# Altium project UC3525_IGBT_Welding_Board.PrjPcb
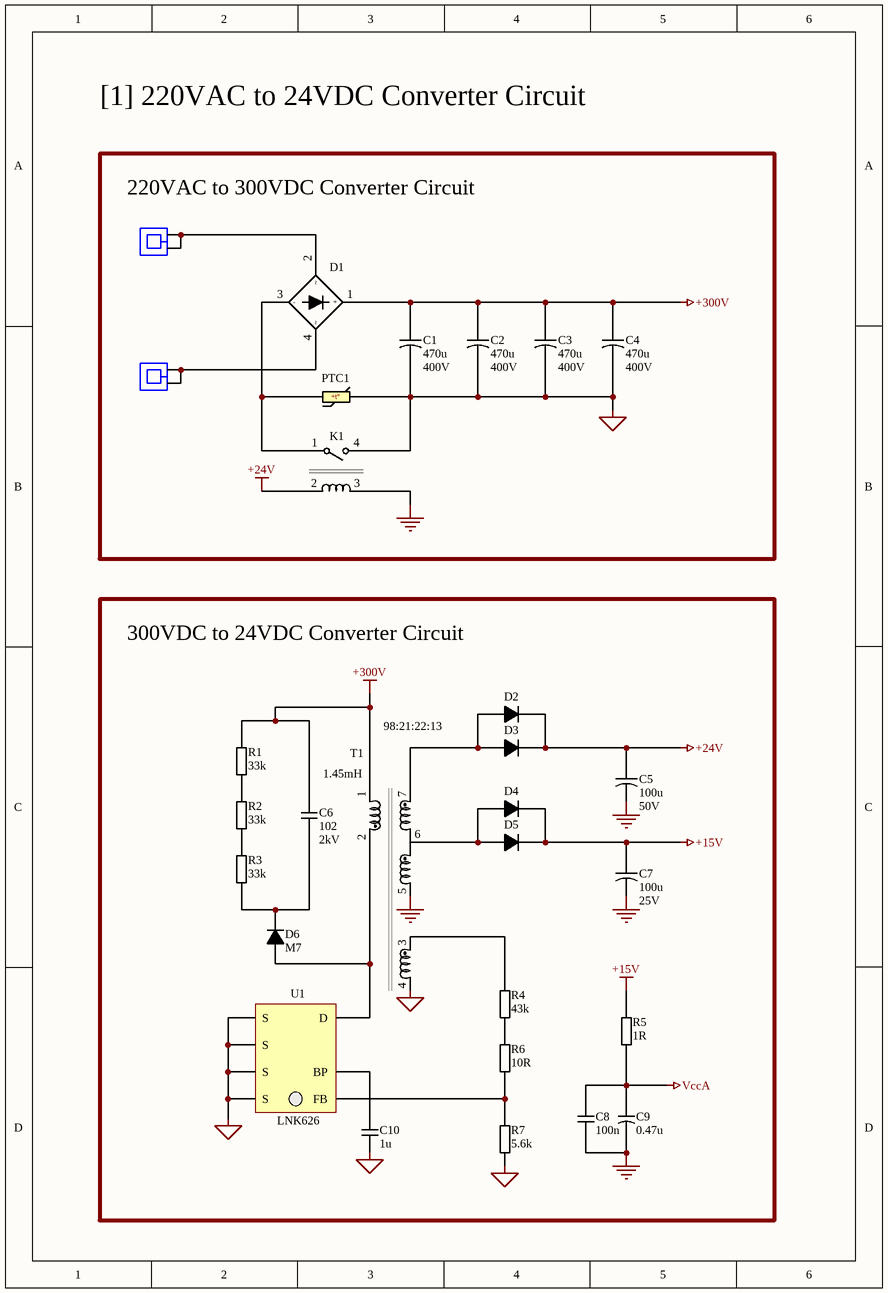
[diagram p0: 220VAC_to_24VDC.SchDoc]
3 sheets, 163 parts. Net scope: flat (ports and power ports of the same name join across sheets).
Board file: UC3525_IGBT_Welding_Board.PcbDoc
Sheets:
  220VAC_to_24VDC.SchDoc
  Control_Circuit.SchDoc
  Half_Bridge_Push_Pull_Circuit.SchDoc

## Sheet 220VAC_to_24VDC.SchDoc
size 165 x 241 mm; DocumentNumber: 1; SheetNumber: 1; SheetTotal: 3

### Parts
C1  470u  Voltage: 400V  [Cap_THD_Alum_10mm]
C2  470u  Voltage: 400V  [Cap_THD_Alum_10mm]
C3  470u  Voltage: 400V  [Cap_THD_Alum_10mm]
C4  470u  Voltage: 400V  [Cap_THD_Alum_10mm]
C5  100u  Voltage: 50V  [Cap_THD_Alum_2.5mm]
C6  102  Voltage: 2kV  [Cap_THD_HVCeramic_5mm]
C7  100u  Voltage: 25V  [Cap_THD_Alum_2.5mm]
C8  100n  [Cap_SMD_0805]
C9  0.47u  [Cap_THD_Tantalum_2.5mm]
C10  1u  [Cap_SMD_0805]
D1  D  [Bridge_THD_14.3mm]  (value not drawn)
D2  UF4007  [Diode_THD_10.8mm]  (value not drawn)
D3  UF4007  [Diode_THD_10.8mm]  (value not drawn)
D4  UF4007  [Diode_THD_10.8mm]  (value not drawn)
D5  UF4007  [Diode_THD_10.8mm]  (value not drawn)
D6  M7  [Diode_SMD_3.9mm]
J1  63824-1  [CONN_QC_Faston_5mm]  (value not drawn)
J2  63824-1  [CONN_QC_Faston_5mm]  (value not drawn)
K1  K  [Relay_10mm]  (value not drawn)
PTC1  (no value)  [PTC_THD_5mm]
R1  33k  [Res_SMD_0805]
R2  33k  [Res_SMD_0805]
R3  33k  [Res_SMD_0805]
R4  43k  [Res_SMD_0805]
R5  1R  [Res_SMD_2512]
R6  10R  [Res_SMD_0805]
R7  5.6k  [Res_SMD_0805]
T1  1.45mH  Turns Ratio: 98:21:22:13  [XFMR_BR22EEL_1179A]
U1  LNK626  [DIP8]

### Blocks framed on the sheet
220VAC to 300VDC Converter Circuit: C1-C4 D1 J1 J2 K1 PTC1
300VDC to 24VDC Converter Circuit: C5-C10 D2-D6 R1-R7 T1 U1

### Nets
+15V: C7.1(+) D4.2(K) D5.2(K) R5.1
+24V: C5.1(+) D2.2(K) D3.2(K) K1.2(Coil_1)
+300V: C1.1(+) C2.1(+) C3.1(+) C4.1(+) C6.2 D1.1(+) R1.2 T1.1
GND: C5.2(-) C7.2(-) C8.1 C9.2(-) K1.3(Coil_2) T1.5
GND_1: C1.2(-) C2.2(-) C3.2(-) C4.2(-) C10.1 K1.4(SW_2) PTC1.2 R7.1 T1.4 U1.5(S) U1.6(S) U1.7(S) U1.8(S)
VccA: C8.2 C9.1(+) R5.2
NetC6_1: C6.1 D6.1(K) R3.1
NetC10_2: C10.2 U1.2(BP)
NetD1_2: D1.2 J1.1 J1.2
NetD1_3: D1.3(-) K1.1(SW_1) PTC1.1
NetD1_4: D1.4 J2.1 J2.2
NetD2_1: D2.1(A) D3.1(A) T1.7
NetD4_1: D4.1(A) D5.1(A) T1.6
NetD6_2: D6.2(A) T1.2 U1.4(D)
NetR1_1: R1.1 R2.2
NetR2_1: R2.1 R3.2
NetR4_1: R4.1 R6.2
NetR4_2: R4.2 T1.3
NetR6_1: R6.1 R7.2 U1.1(FB)

Not connected (* = marked no-connect by the designer): U1 3(NC)

### Notes on the sheet
- [1] 220VAC to 24VDC Converter Circuit
- (in symbol ICL_PTC) +t°

### Library data of the parts
C1-C5 C7 = Cap_THD_Alum: THD Aluminum Capacitor
C6 = Cap_THD_Ceramic: THD Ceramic Capacitor
C8 C10 = Cap_SMD_0805: 0805 SMD Capacitor
C9 = Cap_THD_Tantalum_2.5mm: Voltage: V
D1 = Diode_Bridge_V1: Full Wave Diode Bridge 1
D2-D6 = Diode_Rectifier: Rectifier Diode
J1 J2 = CONN_QC_Faston: Quick Connect Terminal; Manufacturer: TE Connectivity; Body Material: Brass; Plating: Tin; Gender: Male; Insulation: Non-Insulated; Tab Width: 6.35mm; Tab Thickness: 0.83mm; Mating Tab Width: 0.25inch; Hole Diameter: 0.055inch; PCB Thickness: 0.062inch; Supplier 1: Arrow Electronics; Manufacturer Part Number: 63824-1; RoHS: Yes; Category: Terminals; Stock 1: 23665; Pricing 1: 1=0.0808, 10=0.0729, 25=0.053, 100=0.0524, 250=0.0519, 500=0.0514, 1000=0.0509, 3000=0.0504, 6000=0.0448, 15000=0.0426 (USD); Mount: Through Hole; Contact Material: Brass; Contact Plating: Tin; Color: Silver; Material: Brass; Body Plating: Tin; Terminal Material: Brass; Min Operating Temperature: -30°C; Max Operating Temperature: 110°C; Package Quantity: 10000; Packaging: Tape and Reel; Termination: Tab; Orientation: Straight; Series: Faston; Length: 13.63mm; Height: 14.02mm; Depth: 7.92mm; Size: 0.032inch; Radiation Hardening: No; Lead Free: Lead Free; ELV: Compliant; RoHS Compliant: Yes; Reach SVHC Compliant: Unknown; ComponentLink1URL: https://datasheet.ciiva.com/11721/0900766b80ddd72b-11721738.pdf?src-supplier=Rs; ComponentLink1Description: https://datasheet.ciiva.com/11721/0900766b80ddd72b-11721738.pdf?src-supplier=Rs; ComponentLink2URL: https://datasheet.ciiva.com/839/eng-cd-63824-r-basefilename-839115.pdf?src-supplier=Digi-Key; ComponentLink2Description: https://datasheet.ciiva.com/839/eng-cd-63824-r-basefilename-839115.pdf?src-supplier=Digi-Key; ComponentLink3URL: https://datasheet.ciiva.com/46393/1650963-46393511.pdf?src-supplier=Element14; ComponentLink3Description: https://datasheet.ciiva.com/46393/1650963-46393511.pdf?src-supplier=Element14; ComponentLink4URL: https://datasheet.ciiva.com/7873/1650963-7873563.pdf?src-supplier=Element14; ComponentLink4Description: https://datasheet.ciiva.com/7873/1650963-7873563.pdf?src-supplier=Element14; ComponentLink5URL: https://datasheet.ciiva.com/3144/eng-cs-82004-faston-pcb-tabs-receptacles-0914-3144076.pdf?src-supplier=Avnet; ComponentLink5Description: https://datasheet.ciiva.com/3144/eng-cs-82004-faston-pcb-tabs-receptacles-0914-3144076.pdf?src-supplier=Avnet; Supplier Part Number 1: 63824-1
K1 = Relay_Generic_V2
PTC1 = ICL_PTC: PTC Inrush Current Limiters
R1-R7 = Res_SMD: SMD Resistor
T1 = XFMR_BR22EEL_1179A: 98:21:22:13 Pulse Transformer; Lprimary: 1.45mH

## Sheet Control_Circuit.SchDoc
size A3; DocumentNumber: 2; SheetNumber: 2; SheetTotal: 3
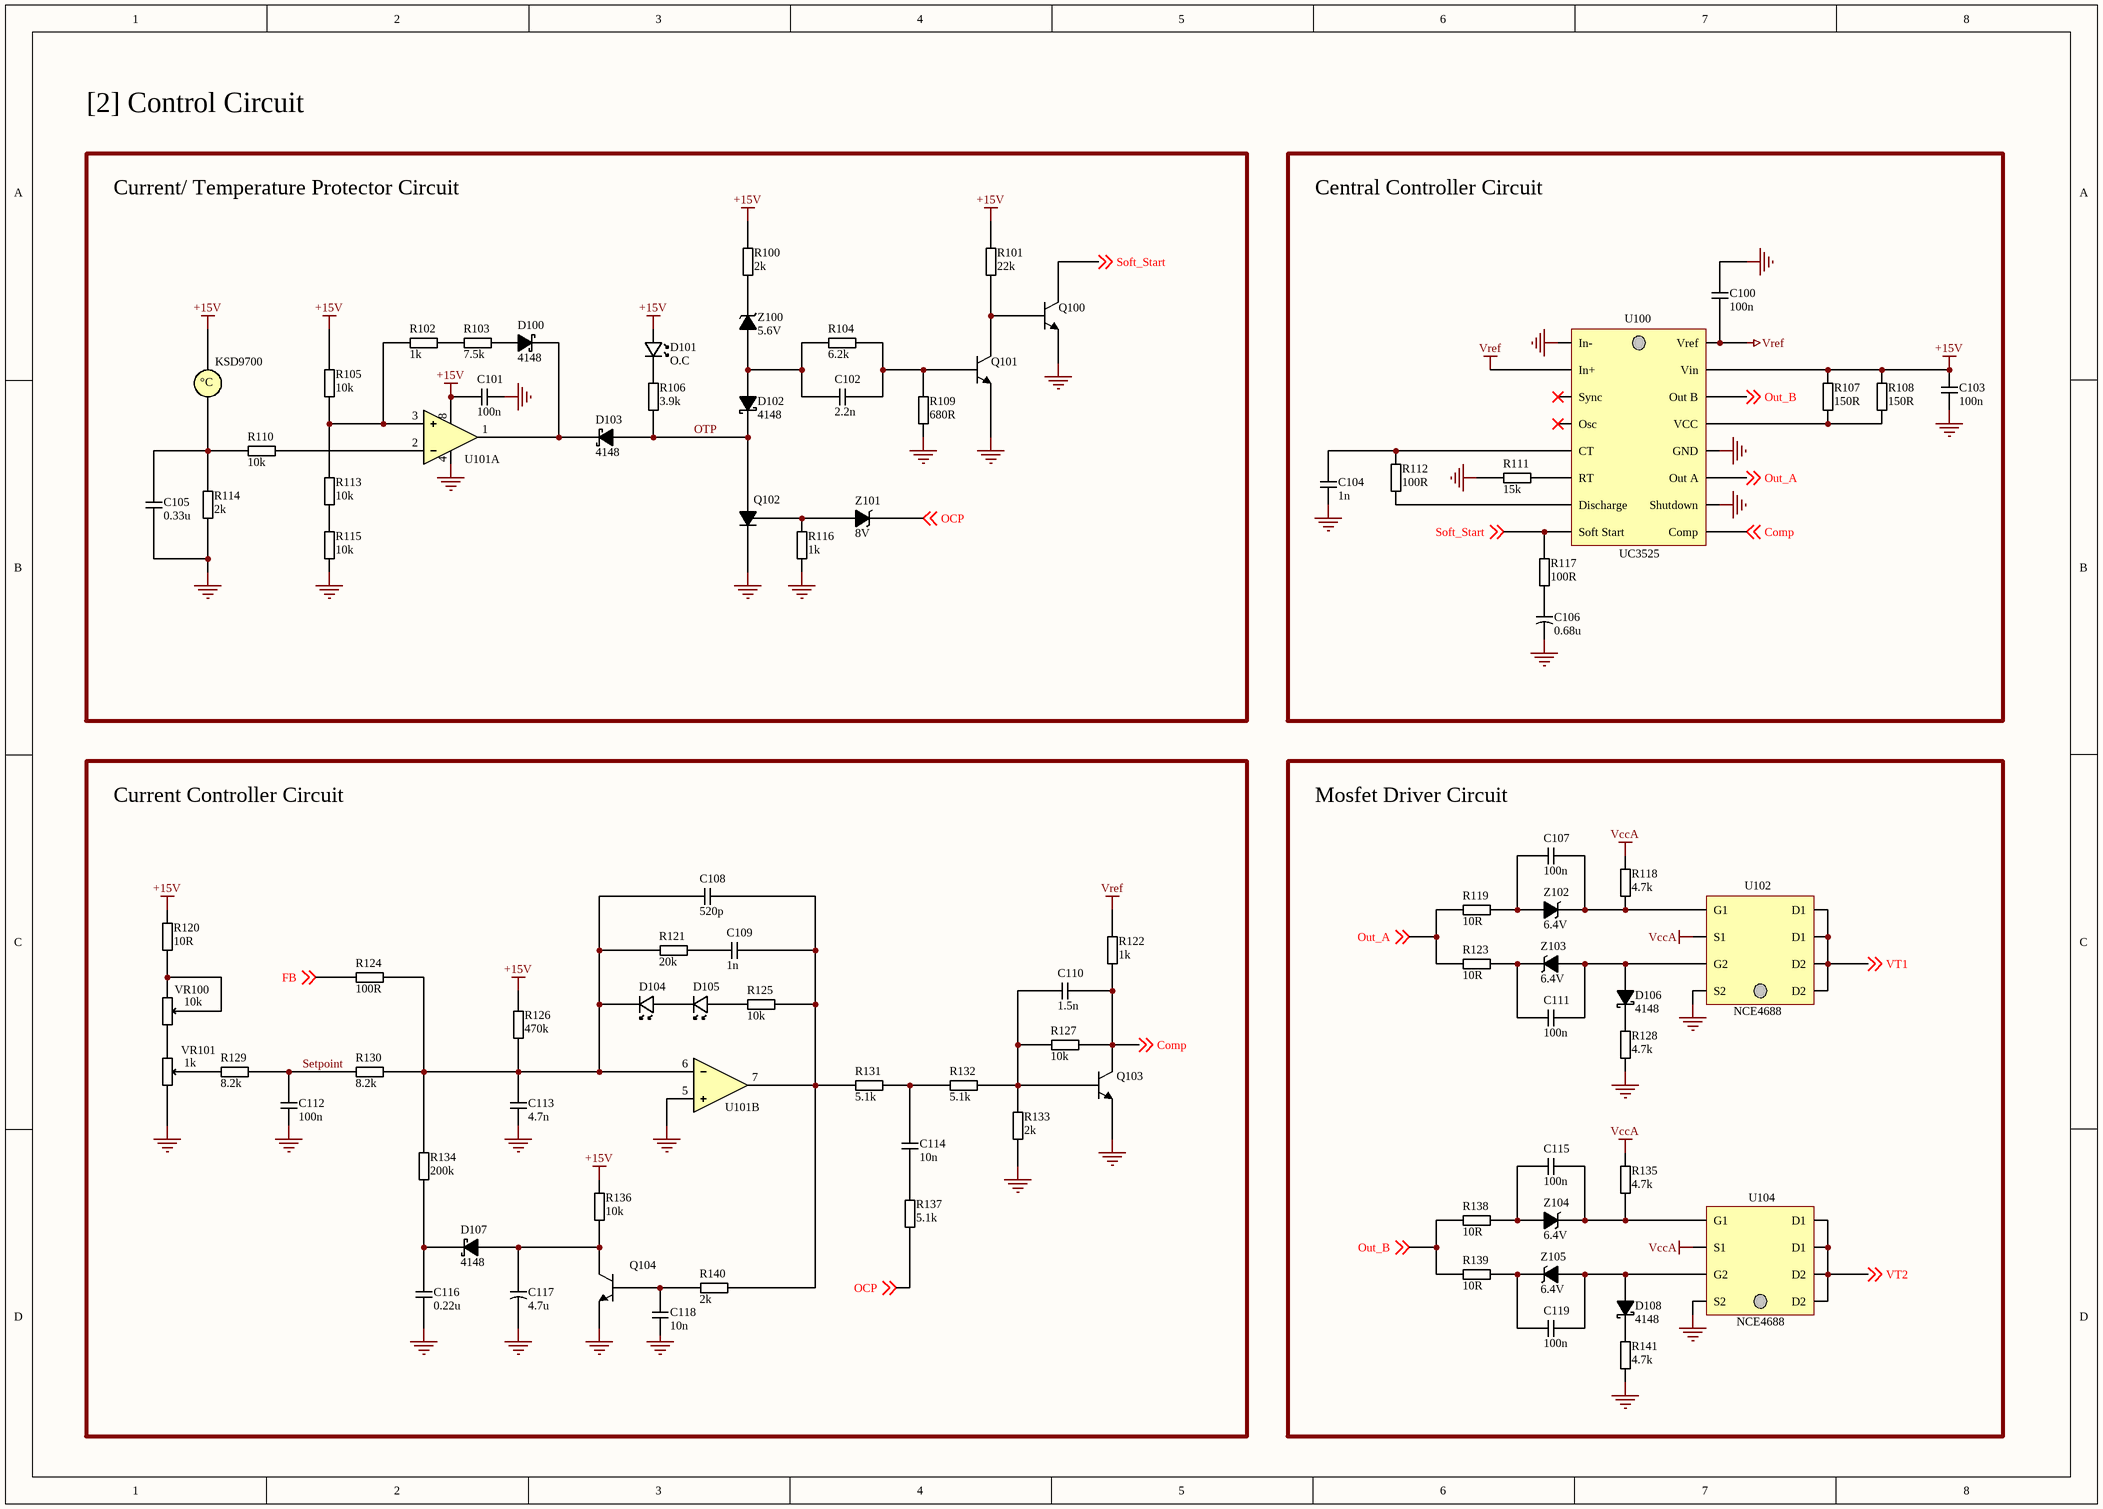
[diagram p1: Control_Circuit.SchDoc]

### Parts
C100  100n  [Cap_SMD_0805]
C101  100n  [Cap_SMD_0805]
C102  2.2n  [Cap_SMD_0805]
C103  100n  [Cap_SMD_0805]
C104  1n  [Cap_SMD_0805]
C105  0.33u  [Cap_SMD_0805]
C106  0.68u  [Cap_THD_Tantalum_2.5mm]
C107  100n  [Cap_SMD_0805]
C108  520p  [Cap_SMD_0805]
C109  1n  [Cap_SMD_0805]
C110  1.5n  [Cap_SMD_0805]
C111  100n  [Cap_SMD_0805]
C112  100n  [Cap_SMD_0805]
C113  4.7n  [Cap_SMD_0805]
C114  10n  [Cap_SMD_0805]
C115  100n  [Cap_SMD_0805]
C116  0.22u  [Cap_SMD_0805]
C117  4.7u  [Cap_THD_Tantalum_2.5mm]
C118  10n  [Cap_SMD_0805]
C119  100n  [Cap_SMD_0805]
D100  4148  [Diode_SMD_4.8mm]
D101  O.C  [Led_SMD_0805]
D102  4148  [Diode_SMD_4.8mm]
D103  4148  [Diode_SMD_4.8mm]
D104  D  [Led_SMD_0805]  (value not drawn)
D105  D  [Led_SMD_0805]  (value not drawn)
D106  4148  [Diode_SMD_4.8mm]
D107  4148  [Diode_SMD_4.8mm]
D108  4148  [Diode_SMD_4.8mm]
K100  KSD9700  [CONN_XH_2P_2.5mm]
Q100  8050  [SOT23 - 2mm]  (value not drawn)
Q101  8050  [SOT23 - 2mm]  (value not drawn)
Q102  MCR100-6  [SOT23 - 2mm]  (value not drawn)
Q103  8050  [SOT23 - 2mm]  (value not drawn)
Q104  8050  [SOT23 - 2mm]  (value not drawn)
R100  2k  [Res_SMD_0805]
R101  22k  [Res_SMD_0805]
R102  1k  [Res_SMD_0805]
R103  7.5k  [Res_SMD_0805]
R104  6.2k  [Res_SMD_0805]
R105  10k  [Res_SMD_0805]
R106  3.9k  [Res_SMD_0805]
R107  150R  [Res_SMD_0805]
R108  150R  [Res_SMD_0805]
R109  680R  [Res_SMD_0805]
R110  10k  [Res_SMD_0805]
R111  15k  [Res_SMD_0805]
R112  100R  [Res_SMD_0805]
R113  10k  [Res_SMD_0805]
R114  2k  [Res_SMD_0805]
R115  10k  [Res_SMD_0805]
R116  1k  [Res_SMD_0805]
R117  100R  [Res_SMD_0805]
R118  4.7k  [Res_SMD_0805]
R119  10R  [Res_SMD_0805]
R120  10R  [Res_SMD_0805]
R121  20k  [Res_SMD_0805]
R122  1k  [Res_SMD_0805]
R123  10R  [Res_SMD_0805]
R124  100R  [Res_SMD_0805]
R125  10k  [Res_SMD_0805]
R126  470k  [Res_SMD_0805]
R127  10k  [Res_SMD_0805]
R128  4.7k  [Res_SMD_0805]
R129  8.2k  [Res_SMD_0805]
R130  8.2k  [Res_SMD_0805]
R131  5.1k  [Res_SMD_0805]
R132  5.1k  [Res_SMD_0805]
R133  2k  [Res_SMD_0805]
R134  200k  [Res_SMD_0805]
R135  4.7k  [Res_SMD_0805]
R136  10k  [Res_SMD_0805]
R137  5.1k  [Res_SMD_0805]
R138  10R  [Res_SMD_0805]
R139  10R  [Res_SMD_0805]
R140  2k  [Res_SMD_0805]
R141  4.7k  [Res_SMD_0805]
U100  UC3525  [SOP16]
U101  OPAMP_LM358_V1  [SOP8]  (value not drawn)  (parts A,B of 2)
U102  NCE4688  [SOP8]
U104  NCE4688  [SOP8]
VR100  10k  [Trimmer_2.54mm]
VR101  1k  [Trimmer_2.54mm]
Z100  5.6V  [Diode_SMD_4.8mm]
Z101  8V  [Diode_SMD_4.8mm]
Z102  6.4V  [Diode_SMD_4.8mm]
Z103  6.4V  [Diode_SMD_4.8mm]
Z104  6.4V  [Diode_SMD_4.8mm]
Z105  6.4V  [Diode_SMD_4.8mm]

### Blocks framed on the sheet
Current/ Temperature Protector Circuit: C101 C102 C105 D100-D103 K100 Q100-Q102 R100-R106 R109 R110 R113-R116 U101 Z100 Z101
Central Controller Circuit: C100 C103 C104 C106 R107 R108 R111 R112 R117 U100
Current Controller Circuit: C108-C110 C112-C114 C116-C118 D104 D105 D107 Q103 Q104 R120-R122 R124-R127 R129-R134 R136 R137 R140 U101 VR100 VR101
Mosfet Driver Circuit: C107 C111 C115 C119 D106 D108 R118 R119 R123 R128 R135 R138 R139 R141 U102 U104 Z102-Z105

### Nets
+15V: C101.2 C103.2 D101.1(A) K100.1 R100.2 R101.2 R105.1 R107.2 R108.2 R120.2 R126.2 R136.2 U100.15(Vin) U101.8(V+)
GND: C100.2 C101.1 C103.1 C104.1 C105.2 C106.2(-) C112.2 C113.2 C116.2 C117.2(-) C118.2 Q100.1(E) Q101.1(E) Q102.2(K) Q103.1(E) Q104.1(E) R109.1 R111.1 R114.1 R115.2 R116.1 R128.2 R133.2 R141.2 U100.1(In-) U100.10(Shutdown) U100.12(GND) U101.4(V-) U101.5(In2+) U102.1(S2) U104.1(S2) VR101.3
VccA: R118.2 R135.1 U102.3(S1) U104.3(S1)
Vref: C100.1 R122.2 U100.2(In+) U100.16(Vref)
Comp: C110.1 Q103.3(C) R122.1 R127.1 U100.9(Comp) ; off-sheet Comp
FB: R124.2 ; off-sheet FB
OCP: R137.1 Z101.2(K) ; off-sheet OCP
OTP: D102.2(K) D103.1(A) Q102.1(A) R106.2
Out_A: R119.1 R123.1 U100.11(Out_A) ; off-sheet Out_A
Out_B: R138.1 R139.1 U100.14(Out_B) ; off-sheet Out_B
Setpoint: C112.1 R129.1 R130.2
Soft_Start: Q100.3(C) R117.2 U100.8(Soft_Start) ; off-sheet Soft_Start
VT1: U102.5(D1) U102.6(D1) U102.7(D2) U102.8(D2) ; off-sheet VT1
VT2: U104.5(D1) U104.6(D1) U104.7(D2) U104.8(D2) ; off-sheet VT2
NetC102_1: C102.1 Q101.2(B) R104.1 R109.2
NetC102_2: C102.2 D102.1(A) R104.2 Z100.1(A)
NetC104_2: C104.2 R112.2 U100.5(CT)
NetC105_1: C105.1 K100.2 R110.1 R114.2
NetC106_1: C106.1(+) R117.1
NetC107_1: C107.1 R118.1 U102.4(G1) Z102.2(K)
NetC107_2: C107.2 R119.2 Z102.1(A)
NetC108_1: C108.1 C109.1 R125.2 R131.1 R140.1 U101.7(Out2)
NetC108_2: C108.2 C113.1 D104.1(K) R121.1 R124.1 R126.1 R130.1 R134.2 U101.6(In2-)
NetC109_2: C109.2 R121.2
NetC110_2: C110.2 Q103.2(B) R127.2 R132.2 R133.1
NetC111_1: C111.1 D106.1(A) U102.2(G2) Z103.1(A)
NetC111_2: C111.2 R123.2 Z103.2(K)
NetC114_1: C114.1 R137.2
NetC114_2: C114.2 R131.2 R132.1
NetC115_1: C115.1 R135.2 U104.4(G1) Z104.2(K)
NetC115_2: C115.2 R138.2 Z104.1(A)
NetC116_1: C116.1 D107.2(K) R134.1
NetC117_1: C117.1(+) D107.1(A) Q104.3(C) R136.1
NetC118_1: C118.1 Q104.2(B) R140.2
NetC119_1: C119.1 D108.1(A) U104.2(G2) Z105.1(A)
NetC119_2: C119.2 R139.2 Z105.2(K)
NetD100_1: D100.1(A) R103.2
NetD100_2: D100.2(K) D103.2(K) U101.1(Out1)
NetD101_2: D101.2(K) R106.1
NetD104_2: D104.2(A) D105.1(K)
NetD105_2: D105.2(A) R125.1
NetD106_2: D106.2(K) R128.1
NetD108_2: D108.2(K) R141.1
NetQ100_2: Q100.2(B) Q101.3(C) R101.1
NetQ102_3: Q102.3(G) R116.2 Z101.1(A)
NetR100_1: R100.1 Z100.2(K)
NetR102_1: R102.1 R105.2 R113.1 U101.3(In1+)
NetR102_2: R102.2 R103.1
NetR107_1: R107.1 R108.1 U100.13(VCC)
NetR110_2: R110.2 U101.2(In1-)
NetR111_2: R111.2 U100.6(RT)
NetR112_1: R112.1 U100.7(Discharge)
NetR113_2: R113.2 R115.1
NetR120_1: R120.1 VR100.1 VR100.2
NetR129_2: R129.2 VR101.2
NetVR100_3: VR100.3 VR101.1

Not connected (* = marked no-connect by the designer): U100 3(Sync)* 4(Osc)*

### Notes on the sheet
- [2] Control Circuit
- (in symbol Relay_KSD9700) °C

### Library data of the parts
C100-C105 C107-C116 C118 C119 = Cap_SMD_0805: 0805 SMD Capacitor
C106 C117 = Cap_THD_Tantalum_2.5mm: Voltage: V
D100 D102 D103 D106-D108 = Diode_Schottky: Schottky Diode
D101 = Diode_LED: Light Emitting Diode - LED
D104 D105 = LED White
K100 = Relay_KSD9700: KSD-9700 series thermal protector
Q100 Q101 Q103 Q104 = BJT_SS8050_V1: Bipolar Transistor BJT NPN Epitaxial Silicon 25V 1500mA 100MHz 1W TO-92-3; Manufacturer: ON Semiconductor / Fairchild; Manufacturer Part Number: SS8050DTA; Max Collector Current: 1.5A; Collector-emitter Voltage-Max: 500mV; hFE Min: 85; Collector Base Voltage (VCBO): 40V; Emitter Base Voltage (VEBO): 6V; Supplier 1: Future Electronics; RoHS: Yes; Category: BJTs; Stock 1: 10000; Pricing 1: 2000=0.0536, 6000=0.0516, 20000=0.0496, 40000=0.0484, 80000=0.0463 (USD); Mount: Through Hole; Case/Package: TO-92-3; Number of Pins: 3; Weight: 0.24g; Min Operating Temperature: -65°C; Max Operating Temperature: 150°C; Packaging: Ammo Pack; Series: -; Package Quantity: 2000; Max Power Dissipation: 1W; Transition Frequency: 100MHz; Collector Emitter Breakdown Voltage: 25V; Polarity: NPN; Collector Emitter Saturation Voltage: 500mV; Gain Bandwidth Product: 100MHz; Voltage Rating (DC): 25V; Collector Emitter Voltage (VCEO): 25V; Max Breakdown Voltage: 25V; Current Rating: 1.5A; Length: 4.58mm; Width: 3.86mm; Height: 4.58mm; Radiation Hardening: No; RoHS Compliant: Yes; Lead Free: Lead Free; Reach SVHC Compliant: No; ComponentLink1URL: https://datasheet.ciiva.com/4721/ss8050-117753-4721333.pdf?src-supplier=Mouser; ComponentLink1Description: https://datasheet.ciiva.com/4721/ss8050-117753-4721333.pdf?src-supplier=Mouser; ComponentLink2URL: https://datasheet.ciiva.com/11207/ss8050-11207512.pdf?src-supplier=Avnet; ComponentLink2Description: https://datasheet.ciiva.com/11207/ss8050-11207512.pdf?src-supplier=Avnet; ComponentLink3URL: https://datasheet.ciiva.com/18648/ss8050-18648133.pdf?src-supplier=Digi-Key; ComponentLink3Description: https://datasheet.ciiva.com/18648/ss8050-18648133.pdf?src-supplier=Digi-Key; ComponentLink4URL: https://datasheet.ciiva.com/17447/ss8050-17447834.pdf?src-supplier=Future+Electronics; ComponentLink4Description: https://datasheet.ciiva.com/17447/ss8050-17447834.pdf?src-supplier=Future+Electronics; ComponentLink5URL: https://datasheet.ciiva.com/46415/1868828-46415608.pdf?src-supplier=Element14; ComponentLink5Description: https://datasheet.ciiva.com/46415/1868828-46415608.pdf?src-supplier=Element14; Supplier Part Number 1: 7178421
Q102 = SCR_MCR100_6_V1: Thyristor SCR 400V 10A 3-Pin TO-92 Tape and Ammo; Manufacturer: ON Semiconductor; Manufacturer Part Number: MCR100-6ZL1G; Hold Current: 5mA; Current Rating: 800mA; Supplier 1: Avnet; RoHS: Yes; Category: SCRs; Stock 1: 1846; Case/Package: TO-92-3; Number of Pins: 3; Min Operating Temperature: -40°C; Max Operating Temperature: 110°C; Voltage Rating (DC): 400V; Packaging: Tape and Reel; Series: -; Package Quantity: 2000; RMS Current (Irms): 800mA; Max Repetitive Reverse Voltage (Vrrm): 400V; Radiation Hardening: No; RoHS Compliant: Yes; Lead Free: Lead Free; ComponentLink1URL: https://datasheet.ciiva.com/3054/mcr100-d-3054696.pdf?src-supplier=Avnet; ComponentLink1Description: https://datasheet.ciiva.com/3054/mcr100-d-3054696.pdf?src-supplier=Avnet; ComponentLink2URL: https://datasheet.ciiva.com/6366/mcr100-d-6366847.pdf?src-supplier=Digi-Key; ComponentLink2Description: https://datasheet.ciiva.com/6366/mcr100-d-6366847.pdf?src-supplier=Digi-Key; ComponentLink3URL: https://datasheet.ciiva.com/16453/mcr100-d-16453261.pdf?src-supplier=Future+Electronics; ComponentLink3Description: https://datasheet.ciiva.com/16453/mcr100-d-16453261.pdf?src-supplier=Future+Electronics; Supplier Part Number 1: MCR100-6ZL1G
R100-R141 = Res_SMD_0805: 0805 SMD Resistor
U100 = PMIC_UC3525: Enhanced 35V, Dual 0.4A 400KHz PWM controller with Low output when off, 0C to 70C 16-PDIP 0 to 70; Manufacturer: Texas Instruments; Manufacturer Part Number: UC3525BN; Output Current: 400mA; Rise Time: 100ns; Number of Outputs: 2; Max Duty Cycle: 49%; Fall Time: 50ns; Topology: Flyback,Push-Pull; Output Voltage: 18V; Output Configuration: Positive; Number of Output Phases: 1; Synchronous Rectifier: Yes; Quiescent Current: 14mA; Supplier 1: Mouser; RoHS: Yes; Category: Voltage Regulators - Switching; Stock 1: 185; Pricing 1: 1=6.72, 10=6.42, 50=5.45, 100=5.2, 1000=4.31, 10000=4.31 (USD); Case/Package: N; Number of Pins: 16; Weight: 0.037172oz; Min Operating Temperature: 0°C; Max Operating Temperature: 70°C; Packaging: Rail/Tube; Switching Frequency: 400kHz; Series: -; Max Supply Voltage: 35V; Duty Cycle: 49%; Clock Sync: Yes; Radiation Hardening: No; Lead Free: Lead Free; RoHS Compliant: Yes; ComponentLink1URL: https://datasheet.ciiva.com/15108/getdatasheetpartid-189083-15108224.pdf?src-supplier=Verical; ComponentLink1Description: https://datasheet.ciiva.com/15108/getdatasheetpartid-189083-15108224.pdf?src-supplier=Verical; ComponentLink2URL: https://datasheet.ciiva.com/2016/uc2525b-2016182.pdf?src-supplier=Digi-Key; ComponentLink2Description: https://datasheet.ciiva.com/2016/uc2525b-2016182.pdf?src-supplier=Digi-Key; ComponentLink3URL: https://datasheet.ciiva.com/14250/slus376-14250904.pdf?src-supplier=Avnet; ComponentLink3Description: https://datasheet.ciiva.com/14250/slus376-14250904.pdf?src-supplier=Avnet; Supplier Part Number 1: 595-UC3525BN
U102 U104 = PMIC_NCE4688: Mosfet Gate Driver
VR100 VR101 = Trimmer
Z100-Z105 = Diode_Zener: Zener Diode

## Sheet Half_Bridge_Push_Pull_Circuit.SchDoc
size 292 x 208 mm; DocumentNumber: 3; SheetNumber: 3; SheetTotal: 3
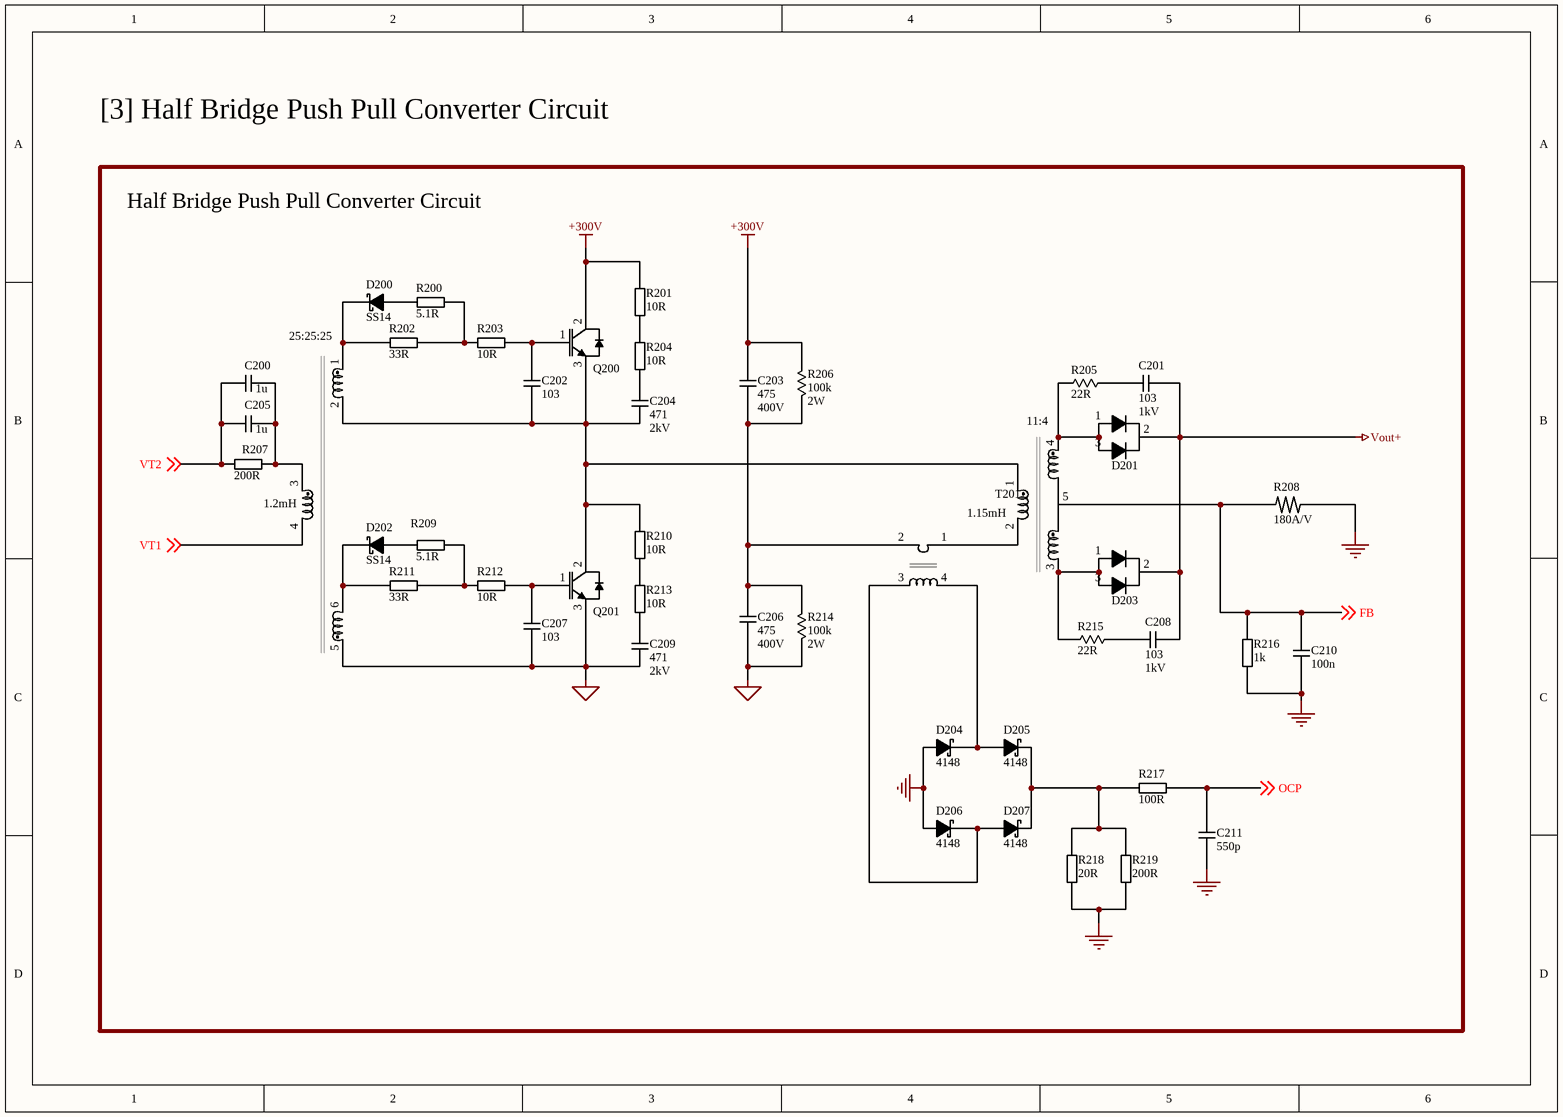
[diagram p2: Half_Bridge_Push_Pull_Circuit.SchDoc]

### Parts
C200  1u  [Cap_SMD_0805]
C201  103  Voltage: 1kV  [Cap_THD_HVCeramic_5mm]
C202  103  [Cap_THD_Ceramic_5mm]
C203  475  Voltage: 400V  [Cap_THD_Film_22.5mm]
C204  471  Voltage: 2kV  [Cap_THD_HVCeramic_5mm]
C205  1u  [Cap_SMD_0805]
C206  475  Voltage: 400V  [Cap_THD_Film_22.5mm]
C207  103  [Cap_THD_Ceramic_5mm]
C208  103  Voltage: 1kV  [Cap_THD_HVCeramic_5mm]
C209  471  Voltage: 2kV  [Cap_THD_HVCeramic_5mm]
C210  100n  [Cap_SMD_0805]
C211  550p  [Cap_SMD_0805]
D200  SS14  [Diode_SMD_4.3mm]
D201  STTH6003  [TO247 - 5.46mm]  (value not drawn)
D202  SS14  [Diode_SMD_4.3mm]
D203  STTH6003  [TO247 - 5.46mm]  (value not drawn)
D204  4148  [Diode_SMD_4.8mm]
D205  4148  [Diode_SMD_4.8mm]
D206  4148  [Diode_SMD_4.8mm]
D207  4148  [Diode_SMD_4.8mm]
Q200  IGBT_RJH60F5  [TO247 - 5.46mm]  (value not drawn)
Q201  IGBT_RJH60F5  [TO247 - 5.46mm]  (value not drawn)
R200  5.1R  [Res_SMD_1206]
R201  10R  [Res_SMD_2512]
R202  33R  [Res_SMD_1206]
R203  10R  [Res_SMD_1206]
R204  10R  [Res_SMD_2512]
R205  22R  [Res_THD_2W_17.6mm]
R206  100k  Power: 2W  [Res_THD_2W_17.6mm]
R207  200R  [Res_SMD_1206]
R208  180A/V  [Res_Shunt]
R209  5.1R  [Res_SMD_1206]
R210  10R  [Res_SMD_2512]
R211  33R  [Res_SMD_1206]
R212  10R  [Res_SMD_1206]
R213  10R  [Res_SMD_2512]
R214  100k  Power: 2W  [Res_THD_2W_17.6mm]
R215  22R  [Res_THD_2W_17.6mm]
R216  1k  [Res_SMD_0805]
R217  100R  [Res_SMD_0805]
R218  20R  [Res_SMD_2512]
R219  200R  [Res_SMD_2512]
T200  1.2mH  Turns Ratio: 25:25:25  [XFMR_BR22EEL_1178A]
T201  1.15mH  Turns Ratio: 11:4  [XFMR_T56]
T202  XFMR_E25  [XFMR_E25]  (value not drawn)

### Blocks framed on the sheet
Half Bridge Push Pull Converter Circuit: C200-C211 D200-D207 Q200 Q201 R200-R219 T200-T202

### Nets
+300V: C203.2 Q200.2(C) R201.2 R206.2
GND: C210.2 C211.2 D204.1(A) D206.1(A) R208.2 R216.2 R218.2 R219.2
GND_1: C206.1 C207.1 C209.1 Q201.3(E) R214.1 T200.5
Vout+: C201.2 C208.2 D201.2(K) D203.2(K)
FB: C210.1 R208.1 R216.1 T201.5 ; off-sheet FB
OCP: C211.1 R217.2 ; off-sheet OCP
VT1: T200.4 ; off-sheet VT1
VT2: C200.1 C205.1 R207.1 ; off-sheet VT2
NetC200_2: C200.2 C205.2 R207.2 T200.3
NetC201_1: C201.1 R205.2
NetC202_1: C202.1 C204.1 Q200.3(E) Q201.2(C) R210.2 T200.2 T201.1
NetC202_2: C202.2 Q200.1(G) R203.2
NetC203_1: C203.1 C206.2 R206.1 R214.2 T202.2
NetC204_2: C204.2 R204.1
NetC207_2: C207.2 Q201.1(G) R212.2
NetC208_1: C208.1 R215.2
NetC209_2: C209.2 R213.1
NetD200_1: D200.1(A) R200.1
NetD200_2: D200.2(K) R202.1 T200.1
NetD201_1: D201.1(A1) D201.3(A2) R205.1 T201.4
NetD202_1: D202.1(A) R209.1
NetD202_2: D202.2(K) R211.1 T200.6
NetD203_1: D203.1(A1) D203.3(A2) R215.1 T201.3
NetD204_2: D204.2(K) D205.1(A) T202.4
NetD205_2: D205.2(K) D207.2(K) R217.1 R218.1 R219.1
NetD206_2: D206.2(K) D207.1(A) T202.3
NetR200_2: R200.2 R202.2 R203.1
NetR201_1: R201.1 R204.2
NetR209_2: R209.2 R211.2 R212.1
NetR210_1: R210.1 R213.2
NetT201_2: T201.2 T202.1

### Notes on the sheet
- [3] Half Bridge Push Pull Converter Circuit

### Library data of the parts
C200 C205 = Cap_SMD_Ceramic: SMD Ceramic Capacitor
C201 C204 C208 C209 = Cap_THD_Ceramic: THD Ceramic Capacitor
C202 C207 = Cap_THD_Ceramic: THD Ceramic Capacitor; Voltage: V
C203 C206 = Cap_THD_Film: THD Film Capacitor
C210 C211 = Cap_SMD_0805: 0805 SMD Capacitor
D200 D202 = Diode_Schottky: Schottky Diode
D201 D203 = Diode_STTH6003: Diode Ultra Fast Recovery Rectifier 300V 60A 3-Pin (3+Tab) TO-247 Tube; Manufacturer: STMicroelectronics; Manufacturer Part Number: STTH6003CW; Max Reverse Current: 60uA; Reverse Recovery Time: 55ns; Peak Non-Repetitive Surge Current: 300A; Forward Voltage: 1.25V; Average Rectified Current: 30A; Supplier 1: Mouser; RoHS: Yes; Category: Rectifier Diodes; Stock 1: 6899; Pricing 1: 1=4.34, 10=3.09, 50=3.09, 100=2.69, 250=2.46, 600=2.2, 1000=2.2, 10000=2.2 (USD); Mount: Through Hole; Case/Package: TO-247; Number of Pins: 3; Min Operating Temperature: -40°C; Max Operating Temperature: 150°C; Forward Current: 60A; Max Repetitive Reverse Voltage (Vrrm): 300V; Max Surge Current: 300A; Packaging: Rail/Tube; Package Quantity: 30; Recovery Time: 55ns; Max Forward Surge Current (Ifsm): 300A; Current Rating: 60A; Voltage Rating (DC): 300V; Reverse Voltage: 300V; Max Reverse Voltage (DC): 300V; Reverse Recovery Time-Max: 55ns; Series: -; Length: 15.75mm; Width: 5.15mm; Height: 20.15mm; Radiation Hardening: No; Reach SVHC Compliant: No; Lead Free: Contains Lead; RoHS Compliant: Yes; ComponentLink1URL: https://datasheet.ciiva.com/16366/cd00001561-16366212.pdf?src-supplier=Future+Electronics; ComponentLink1Description: https://datasheet.ciiva.com/16366/cd00001561-16366212.pdf?src-supplier=Future+Electronics; ComponentLink2URL: https://datasheet.ciiva.com/15144/getdatasheetpartid-43356-15144119.pdf?src-supplier=Verical; ComponentLink2Description: https://datasheet.ciiva.com/15144/getdatasheetpartid-43356-15144119.pdf?src-supplier=Verical; ComponentLink3URL: https://datasheet.ciiva.com/4452/cd00001561-106840-4452745.pdf?src-supplier=Mouser; ComponentLink3Description: https://datasheet.ciiva.com/4452/cd00001561-106840-4452745.pdf?src-supplier=Mouser; ComponentLink4URL: https://datasheet.ciiva.com/14169/spstm-sekundargrdn-stth-6003-en-14169031.pdf?src-supplier=Distrelec; ComponentLink4Description: https://datasheet.ciiva.com/14169/spstm-sekundargrdn-stth-6003-en-14169031.pdf?src-supplier=Distrelec; Supplier Part Number 1: 511-STTH6003CW
D204-D207 = Diode_1N4148: Rectifier Diode Small Signal Switching 100V 0.2A 4ns Automotive 2-Pin DO-35 Ammo; Manufacturer: NXP Semiconductors; Manufacturer Part Number: 1N4148; Forward Current: 200mA; Capacitance: 4pF; Polarity: Standard; Max Forward Surge Current (Ifsm): 4A; Element Configuration: Single; Supplier 1: Arrow Electronics; RoHS: Yes; Category: Uncategorized; Case/Package: SOD; Number of Pins: 2; Max Operating Temperature: 200°C; Packaging: Ammo Pack; Reverse Recovery Time: 4ns; Max Repetitive Reverse Voltage (Vrrm): 100V; Current Rating: 200mA; Voltage Rating (DC): 100V; Output Current: 200mA; Current: 4A; Voltage: 100V; RoHS Compliant: Yes; Lead Free: Lead Free; Reach SVHC Compliant: No; ComponentLink1URL: https://datasheet.ciiva.com/1179/1720485-1179297.pdf?src-supplier=Element14; ComponentLink1Description: https://datasheet.ciiva.com/1179/1720485-1179297.pdf?src-supplier=Element14; ComponentLink2URL: https://datasheet.ciiva.com/26921/getdatasheetpartid-764103-26921186.pdf?src-supplier=Verical; ComponentLink2Description: https://datasheet.ciiva.com/26921/getdatasheetpartid-764103-26921186.pdf?src-supplier=Verical; Supplier Part Number 1: 1N4148
Q200 Q201 = IGBT_RJH60F5: Trans IGBT Chip N-CH 600V 80A 260400mW 3-Pin(3+Tab) TO-247A; Manufacturer: Renesas; Manufacturer Part Number: RJH60F5DPQ-A0#T0; Max Power Dissipation: 260.4W; Reverse Recovery Time: 90ns; Collector Emitter Saturation Voltage: 1.7V; Collector-emitter Voltage-Max: 1.8V; Input Type: STANDARD; Supplier 1: Digi-Key; RoHS: Yes; Category: IGBTs; Mount: Through Hole; Case/Package: TO-247-3; Number of Pins: 3; Max Operating Temperature: 150°C; Package Quantity: 1; Collector Emitter Voltage (VCEO): 600V; Packaging: Rail/Tube; Max Collector Current: 80A; Collector Emitter Breakdown Voltage: 600V; Lead Free: Lead Free; RoHS Compliant: Yes; ComponentLink1URL: https://datasheet.ciiva.com/6388/r07ds0326ej-rjh60f5dpq-6388272.pdf?src-supplier=Digi-Key; ComponentLink1Description: https://datasheet.ciiva.com/6388/r07ds0326ej-rjh60f5dpq-6388272.pdf?src-supplier=Digi-Key; Supplier Part Number 1: RJH60F5DPQ-A0#T0-ND
R200-R204 R207 R209-R213 R217-R219 = Res_SMD: SMD Resistor
R205 R215 = Res_THD: THD Resistor; Power: W
R206 R214 = Res_THD: THD Resistor
R208 = Res_Shunt: Shunt Resistor; Power: W
R216 = Res_SMD_0805: 0805 SMD Resistor
T200 = XFMR_BR22EEL_1178A: 25:25:25 Pulse Transformer; Lprimary: 1.2mH
T201 = XFMR_T56: 11:4 JiTaiXin Pulse Transformer; Lprimary: 1.15mH
T202 = XFMR_E25: 200:1 Current Transformer; Turns Ratio: 200:1

## Nets that join several sheets
+15V: 220VAC_to_24VDC (C7.1 D4.2 D5.2 R5.1), Control_Circuit (14 pins)
+300V: 220VAC_to_24VDC (8 pins), Half_Bridge_Push_Pull_Circuit (C203.2 Q200.2 R201.2 R206.2)
GND: 220VAC_to_24VDC (6 pins), Control_Circuit (32 pins), Half_Bridge_Push_Pull_Circuit (8 pins)
GND_1: 220VAC_to_24VDC (13 pins), Half_Bridge_Push_Pull_Circuit (6 pins)
VccA: 220VAC_to_24VDC (C8.2 C9.1 R5.2), Control_Circuit (R118.2 R135.1 U102.3 U104.3)
FB: Control_Circuit (R124.2), Half_Bridge_Push_Pull_Circuit (C210.1 R208.1 R216.1 T201.5)
OCP: Control_Circuit (R137.1 Z101.2), Half_Bridge_Push_Pull_Circuit (C211.1 R217.2)
VT1: Control_Circuit (U102.5 U102.6 U102.7 U102.8), Half_Bridge_Push_Pull_Circuit (T200.4)
VT2: Control_Circuit (U104.5 U104.6 U104.7 U104.8), Half_Bridge_Push_Pull_Circuit (C200.1 C205.1 R207.1)